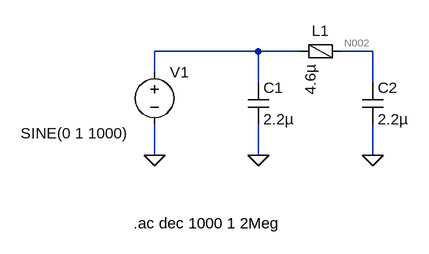
[diagram p0: schematic ps-pi-filter.asc]
ps-pi-filter.asc, the LTspice schematic file:
Version 4
SHEET 1 880 680
WIRE 336 240 176 240
WIRE 400 240 336 240
WIRE 512 240 464 240
WIRE 176 272 176 240
WIRE 336 288 336 240
WIRE 512 288 512 240
WIRE 176 400 176 352
WIRE 336 400 336 352
WIRE 512 400 512 352
FLAG 336 400 0
FLAG 512 400 0
FLAG 176 400 0
SYMBOL FerriteBead 432 240 R90
WINDOW 0 -16 0 VBottom 2
SYMATTR InstName L1
SYMATTR Value 4.6µ
SYMATTR SpiceLine Ipk=1 Rser=107m Rpar=1.05K Cpar=1.15p mfg="Würth Elektronik" pn="742792141 WE-CBF 1206"
SYMBOL cap 320 288 R0
SYMATTR InstName C1
SYMATTR Value 2.2µ
SYMATTR SpiceLine Rser=13.8m Lser=0 mfg="KEMET" pn="C1206C225K3PAC" type="X5R"
SYMBOL voltage 176 256 R0
WINDOW 3 -206 110 Left 2
SYMATTR Value SINE(0 1 1000)
SYMATTR InstName V1
SYMATTR Value2 AC 1
SYMBOL cap 496 288 R0
SYMATTR InstName C2
SYMATTR Value 2.2µ
SYMATTR SpiceLine Rser=13.8m Lser=0 mfg="KEMET" pn="C1206C225K3PAC" type="X5R"
TEXT 144 504 Left 2 !.ac dec 1000 1 2Meg

The netlist it stands for:
* ps-pi-filter.asc
L1 N002 N001 4.6µ Ipk=1 Rser=107m Rpar=1.05K Cpar=1.15p mfg="Würth Elektronik" pn="742792141 WE-CBF 1206"
C1 N001 0 2.2µ Rser=13.8m Lser=0 mfg="KEMET" pn="C1206C225K3PAC" type="X5R"
V1 N001 0 SINE(0 1 1000) AC 1
C2 N002 0 2.2µ Rser=13.8m Lser=0 mfg="KEMET" pn="C1206C225K3PAC" type="X5R"
.ac dec 1000 1 2Meg
.backanno
.end

* Results of the author's LTspice run, read from the files saved beside the schematic
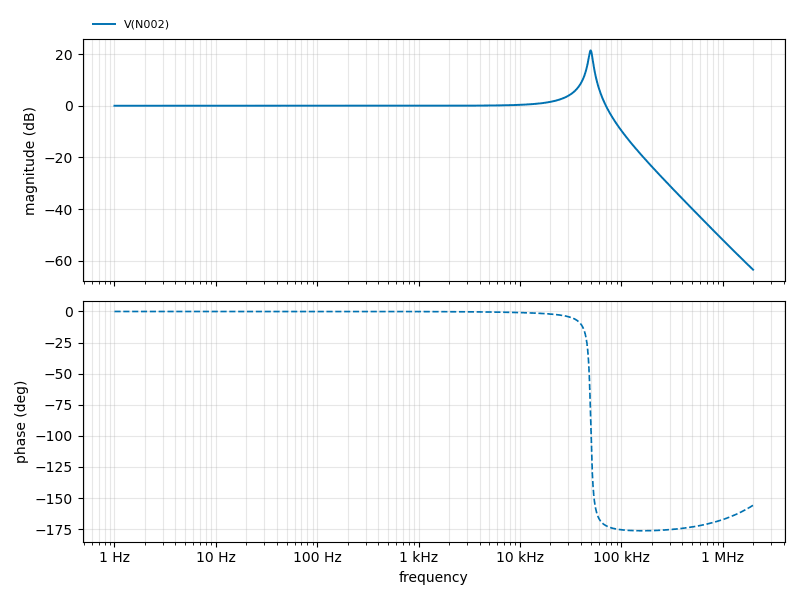
[diagram p1: AC Analysis of ps-pi-filter.asc, plotted from the saved traces]
* AC Analysis, 1 run:
*   V(N002): 0.00 dB at 1 Hz, -63.47 dB at 2 MHz, peak 21.43 dB at 49.89 kHz, 3 dB below the peak at 47.77 kHz and 52.03 kHz